# EAGLE design schematics (EAGLE 9.6.2)
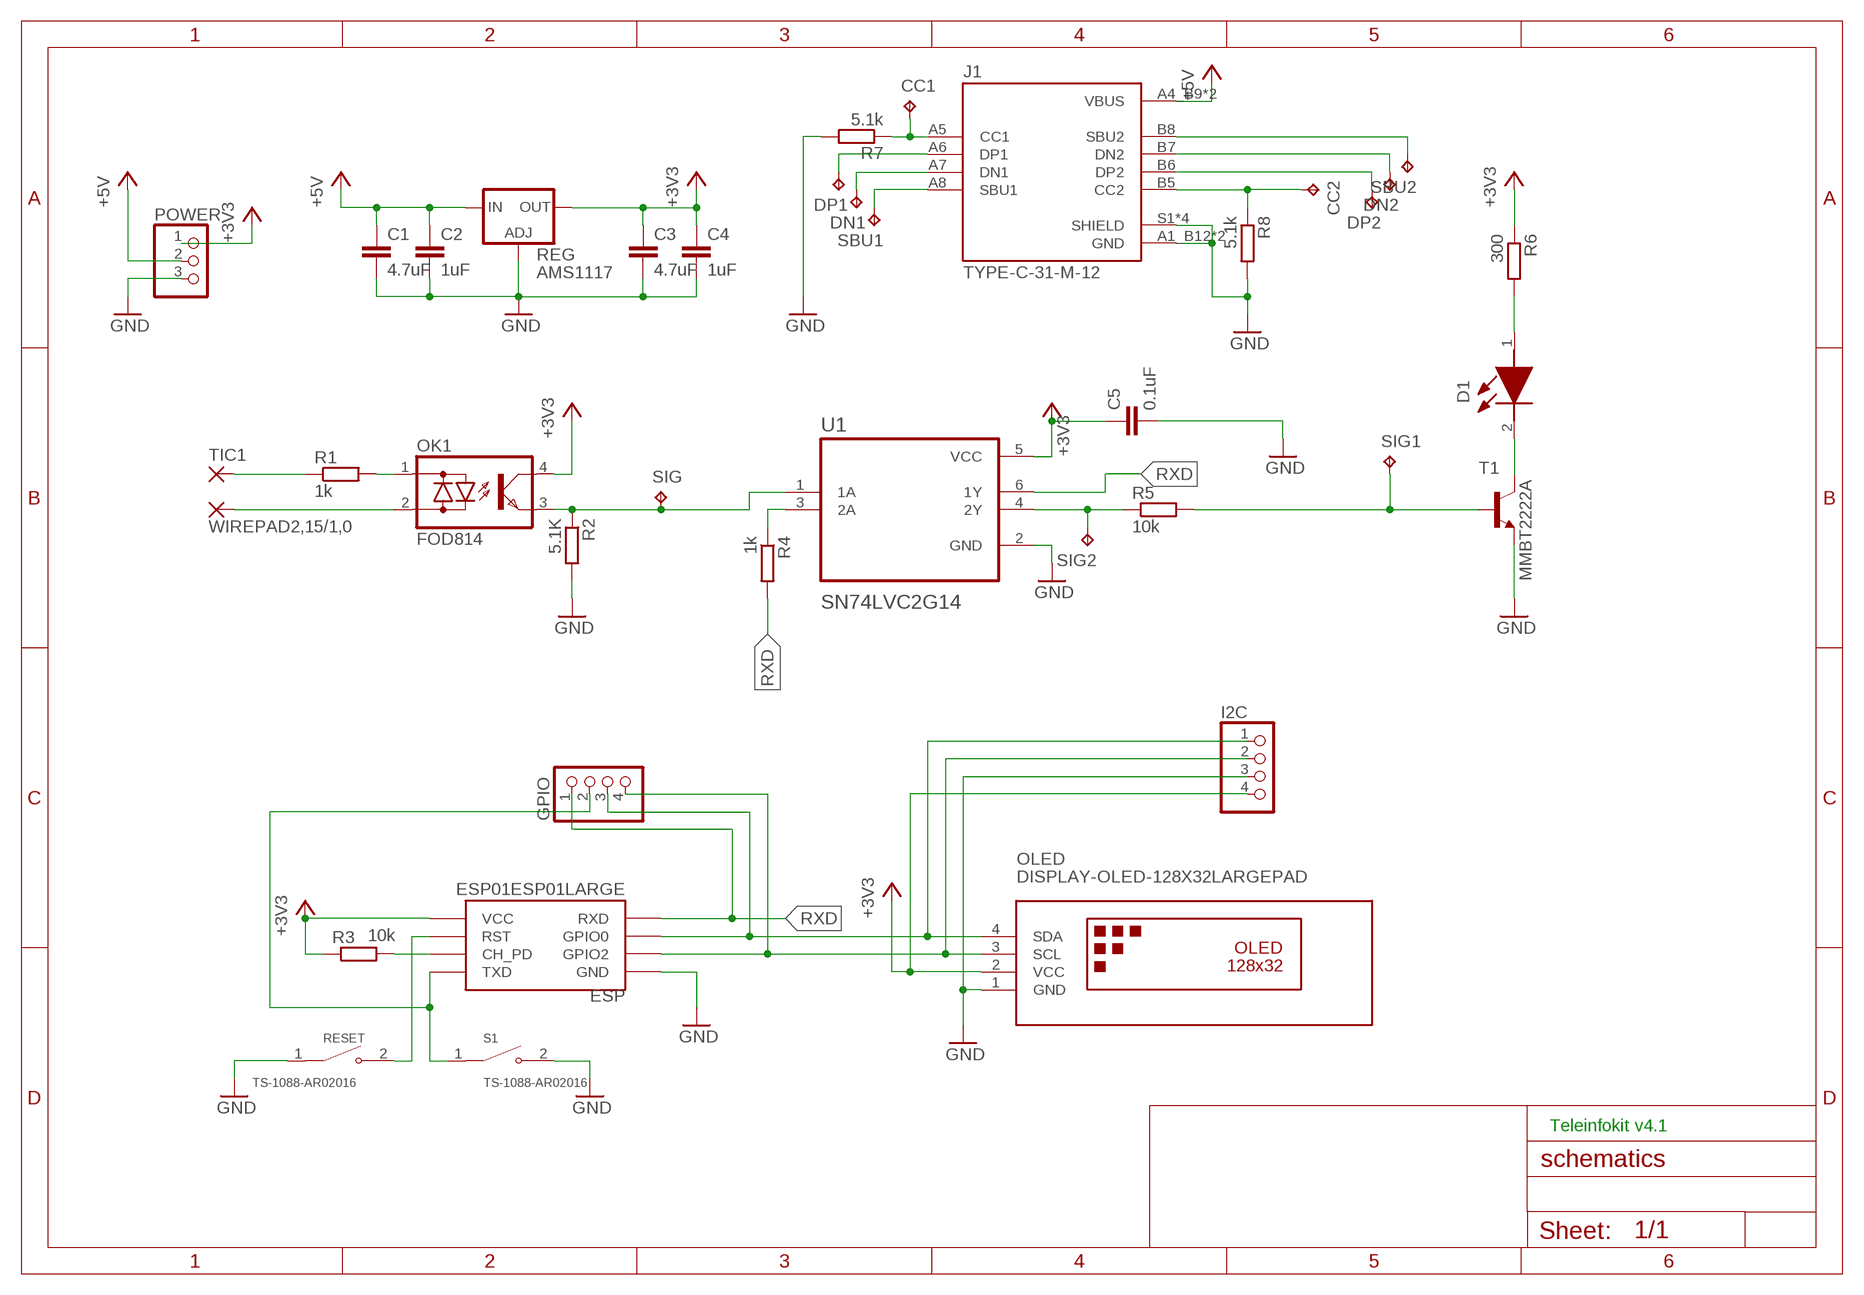
[diagram p0: schematic, sheet 1]

## Parts
C1  4.7uF  C-EUC0805  [C0805]
C2  1uF  C-EUC0805  [C0805]
C3  4.7uF  C-EUC0805  [C0805]
C4  1uF  C-EUC0805  [C0805]
C5  0.1uF  C-EUC0402K  [C0402K]
CC1  TPB1,27  [B1,27]
CC2  TPB1,27  [B1,27]
D1  17-21SURC_S530-A2_TR8  [1721SURCS530A2TR8]
DN1  TPB1,27  [B1,27]
DN2  TPB1,27  [B1,27]
DP1  TPB1,27  [B1,27]
DP2  TPB1,27  [B1,27]
ESP  ESP01ESP01LARGE  [ESP01LARGE]
GPIO  PINHD-1X4  [1X04]
I2C  PINHD-1X4ROUNDLARGE  [1X04ROUNDLARGE]
J1  TYPE-C-31-M-12  [HRO_TYPE-C-31-M-12]
OK1  FOD814  SFH6206  [DIL4-SMD]
OLED  DISPLAY-OLED-128X32LARGEPAD  [DISPLAY-OLED-128X32LARGE]
POWER  PINHD-1X3  [1X03]
R1  1k  R-EU_R0805  [R0805]
R2  5.1K  R-EU_R0603  [R0603]
R3  10k  R-EU_R0805  [R0805]
R4  1k  R-EU_R0805  [R0805]
R5  10k  R-EU_R0805  [R0805]
R6  300  R-EU_R0805  [R0805]
R7  5.1k  R-EU_R0402  [R0402]
R8  5.1k  R-EU_R0402  [R0402]
REG  AMS1117  LD117AS33TR  [SOT223]
RESET  TS-1088-AR02016  [SW_TS-1088-AR02016]
S1  TS-1088-AR02016  [SW_TS-1088-AR02016]
SBU1  TPB1,27  [B1,27]
SBU2  TPB1,27  [B1,27]
SIG  TPB1,27  [B1,27]
SIG1  TPB1,27  [B1,27]
SIG2  TPB1,27  [B1,27]
T1  MMBT2222A  MMBT2222ALT1-NPN-SOT23-BEC  [SOT23-BEC]
TIC1  WIREPAD2,15/1,0  [2,15/1,0]
TIC2  WIREPAD2,15/1,0  [2,15/1,0]
U1  SN74LVC2G14  SN74LVC2G14DBVR  [SOT95P280X145-6N]

## Nets
+3V3: C3.1 C4.1 C5.1 ESP.VCC I2C.4 OK1.4(C) OLED.2(VCC) POWER.1 R3.1 R6.1 REG.4(OUT) U1.5(VCC)
+5V: C1.1 C2.1 J1.A4_B9(VBUS) J1.B4_A9(VBUS) POWER.2 REG.3(IN)
GND: C1.2 C2.2 C3.2 C4.2 C5.2 ESP.GND I2C.3 J1.A1_B12(GND) J1.B1_A12(GND) J1.S1(SHIELD) J1.S2(SHIELD) J1.S3(SHIELD) J1.S4(SHIELD) OLED.1(GND) POWER.3 R2.2 R7.2 R8.2 REG.1(ADJ) RESET.1 S1.2 T1.E U1.2(GND)
N$1: OK1.1(AC1) R1.2
N$2: ESP.GPIO0 GPIO.3 I2C.1 OLED.4(SDA)
N$3: D1.1(A) R6.2
N$4: ESP.TX(TXD) GPIO.2 S1.1
N$5: R5.1 SIG2.TP U1.4(2Y)
N$6: ESP.GPIO2 GPIO.4 I2C.2 OLED.3(SCL)
N$7: R1.1 TIC1.1(P)
N$8: OK1.2(AC2) TIC2.1(P)
N$9: ESP.CH_PD R3.2
N$10: ESP.RST RESET.2
N$11: OK1.3(E) R2.1 SIG.TP U1.1(1A)
N$12: D1.2(K) T1.C
N$13: R5.2 SIG1.TP T1.B
N$14: CC1.TP J1.A5(CC1) R7.1
N$15: R4.1 U1.3(2A)
N$16: CC2.TP J1.B5(CC2) R8.1
N$17: DP1.TP J1.A6(DP1)
N$18: DN1.TP J1.A7(DN1)
N$19: J1.A8(SBU1) SBU1.TP
N$20: J1.B8(SBU2) SBU2.TP
N$21: DN2.TP J1.B7(DN2)
N$22: DP2.TP J1.B6(DP2)
RXD: ESP.RX(RXD) GPIO.1 R4.2 U1.6(1Y)

## Notes on the sheet
- Teleinfokit v4.1

## Library data of the parts
C1 C3 = rcl:C-EU: CAPACITOR, European symbol; LCSC_PART: C1779; SPICEPREFIX: C
C2 C4 = rcl:C-EU: CAPACITOR, European symbol; LCSC_PART: C28323; SPICEPREFIX: C
C5 = rcl:C-EU: CAPACITOR, European symbol; LCSC_PART: C1525; SPICEPREFIX: C
CC1 CC2 DN1 DN2 DP1 DP2 SBU1 SBU2 SIG SIG1 SIG2 = testpad:TP: Test pad
D1 = 17-21SURC_S530-A2_TR8:17-21SURC_S530-A2_TR8: Standard LEDs - SMD 1.1mm Height Source: Datasheet <https://media.digikey.com/pdf/Data Sheets/Everlight PDFs/17-21SURC-S530-A2-TR8-V5~.pdf>; ARROW_PART_NUMBER: 17-21SURC/S530-A2/TR8; ARROW_PRICE-STOCK: https://www.arrow.com/en/products/17-21surcs530-a2tr8/everlight-electronics; DESCRIPTION: Standard LEDs - SMD 1.1mm Height; HEIGHT: mm; MANUFACTURER_NAME: Everlight; MANUFACTURER_PART_NUMBER: 17-21SURC/S530-A2/TR8; MOUSER_PART_NUMBER: N/A; MOUSER_PRICE-STOCK: https://www.mouser.co.uk/ProductDetail/Everlight/17-21SURC-S530-A2-TR8?qs=8cKuZ6Ok2lY9160apvjjyQ%3D%3D
ESP = esp8266modules-edit:ESP01: ESP8266 Wifi module 01; LCSC_PART: C2935984
GPIO = pinhead:PINHD-1X4: PIN HEADER
I2C = pinhead-edit:PINHD-1X4: PIN HEADER
J1 = TYPE-C-31-M-12:TYPE-C-31-M-12: Check availability <https://pricing.snapeda.com/parts/TYPE-C-31-M-12/HRO%20Electronics%20Co.%2C%20Ltd./view-part?ref=eda>; AVAILABILITY: Not in stock; DESCRIPTION: USB Connectors 24 Receptacle 1 8.94*7.3mm RoHS; LCSC_PART: C165948; MF: HRO Electronics Co., Ltd.; MP: TYPE-C-31-M-12; PACKAGE: Package; PRICE: None
OK1 = optocoupler:SFH620: Optocoupler, Phototransistor Output, AC Input Source: http://www.vishay.com/docs/83675/sfh620.pdf; LCSC_PART: C479718; MF: VISHAY/TELEFUNKEN; MPN: SFH6206-3; OC_FARNELL: 1469585; OC_NEWARK: 58K2214
OLED = oled-edit:DISPLAY-OLED-128X32: 128x32 Dot Matrix OLED Module with I2C interface based on SSD1306 chip More details available here: http://www.tinyosshop.com/index.php?route=product/product&product_id=953 Schematic available here: http://www.tinyosshop.com/datasheet/OLED%2012832.pdf SSD1306 datasheet: https://cdn-shop.adafruit.com/datasheets/SSD1306.pdf Click here to find device on ebay.com <http://www.ebay.com/sch/oled+display+128x32+i2c>; LCSC_PART: C2718488
POWER = pinhead:PINHD-1X3: PIN HEADER
R1 = rcl:R-EU_: RESISTOR, European symbol; LCSC_PART: C17513; SPICEPREFIX: R
R2 = rcl:R-EU_: RESISTOR, European symbol; LCSC_PART: C23186; SPICEPREFIX: R
R3-R5 = rcl:R-EU_: RESISTOR, European symbol; LCSC_PART: C17414; SPICEPREFIX: R
R6 = rcl:R-EU_: RESISTOR, European symbol; LCSC_PART: C17617; SPICEPREFIX: R
R7 R8 = rcl:R-EU_: RESISTOR, European symbol; LCSC_PART: C25905; SPICEPREFIX: R
REG = v-reg:LD117A?*: Low drop fixed and adjustable positive voltage regulators 1 A Source: http://www.st.com/stonline/products/literature/ds/7194/ld1117axx.pdf; LCSC_PART: C6186
RESET S1 = TS-1088-AR02016:TS-1088-AR02016: Check availability <https://pricing.snapeda.com/parts/TS-1088-AR02016/Xunpu/view-part?ref=eda>; AVAILABILITY: Not in stock; CHECK_PRICES: https://www.snapeda.com/parts/TS-1088-AR02016/Xunpu/view-part/?ref=eda; DESCRIPTION: 50mA 4mm 100MΩ 100,000 Times 12V 160gf 3mm 2mm Round Button Vertical welding SPST SMD Tactile Switches ROHS; LCSC_PART: C720477; MF: Xunpu; MP: TS-1088-AR02016; PACKAGE: Package; PRICE: None; SNAPEDA_LINK: https://www.snapeda.com/parts/TS-1088-AR02016/Xunpu/view-part/?ref=snap
T1 = transistor:*-NPN-: NPN Transistror BF959 corrected 2008.03.06; LCSC_PART: C8512
TIC1 TIC2 = wirepad:WIREPAD: Wire PAD connect wire on PCB
U1 = SN74LVC2G14DBVR:SN74LVC2G14DBVR: Check availability <https://pricing.snapeda.com/parts/SN74LVC2G14DBVR/Texas%20Instruments/view-part?ref=eda>; AVAILABILITY: In Stock; DESCRIPTION: 2-ch, 1.65-V to 5.5-V inverters with Schmitt-Trigger inputs; LCSC_PART: C12401; MF: Texas Instruments; MP: SN74LVC2G14DBVR; PACKAGE: SOT-23-6 Texas Instruments; PRICE: None; PURCHASE-URL: https://pricing.snapeda.com/search/part/SN74LVC2G14DBVR/?ref=eda

## Board
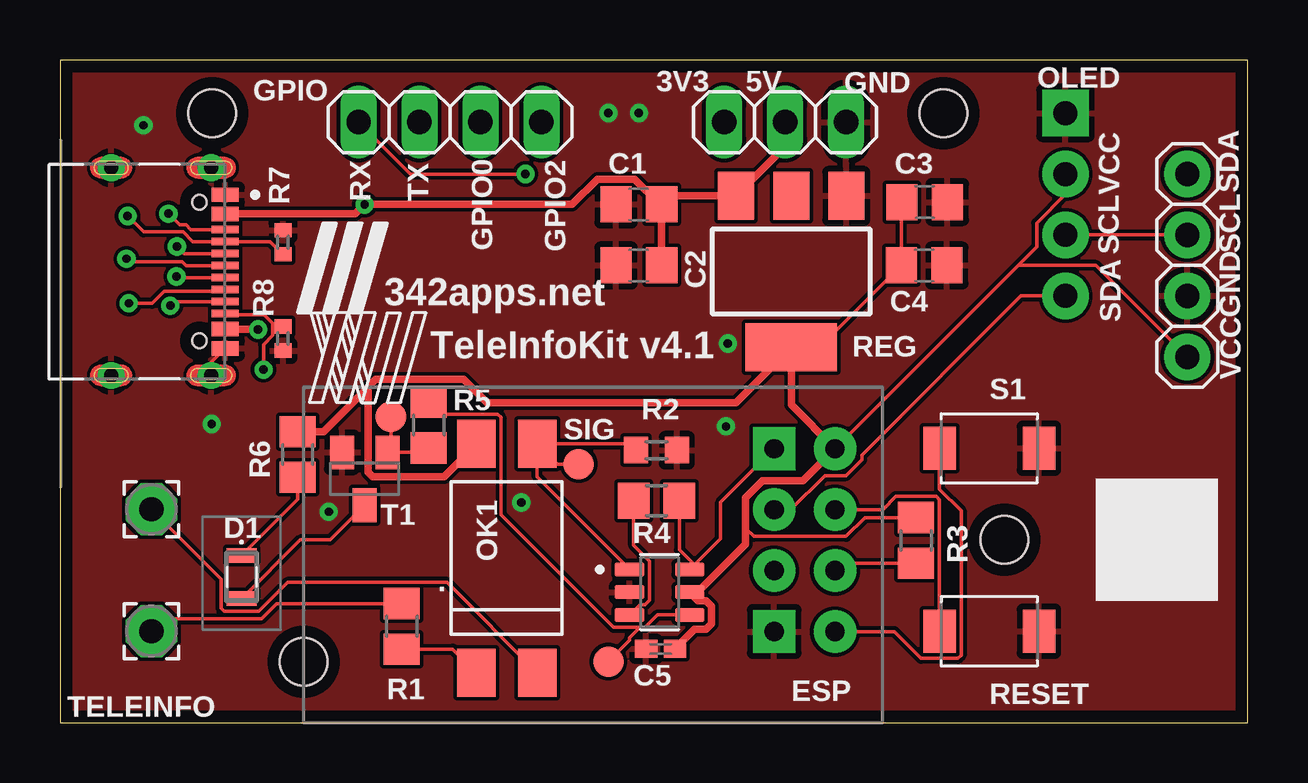
[diagram p1: board, top side]
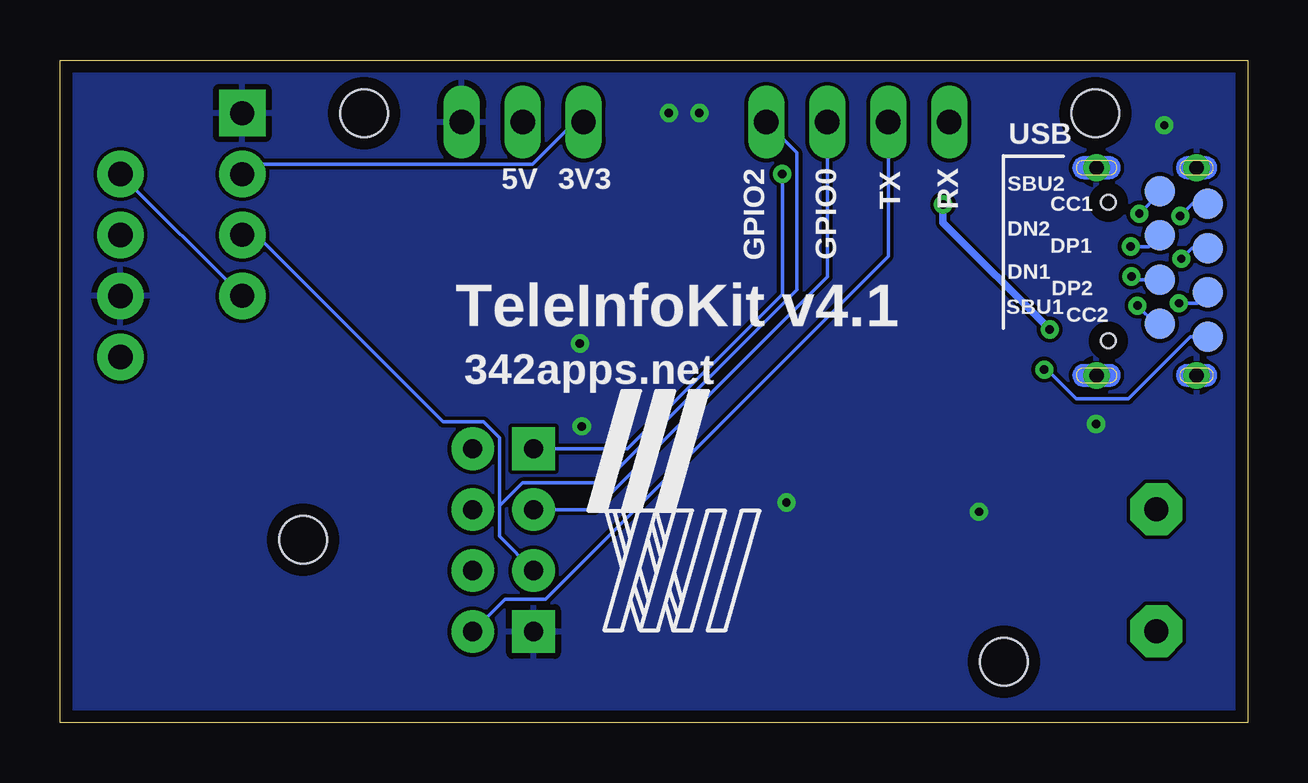
[diagram p2: board, bottom side, seen from below]

Size 49.51 x 27.61 mm. Coordinates in mm from the lower left corner, seen from the top.
Outline: 0,0 49.51,0 49.51,27.61 0,27.61 0,0
Copper layers (1*16): Top 0.035mm / dielectric 1.5mm / Bottom 0.035mm
Design rules "default *": minimum track width 6mil, minimum drill 0.35mm, track to track 6mil, track to pad 6mil, pad to pad 6mil, via to via 6mil, smd to smd 6mil, copper to edge 20mil, drill to drill 6mil, minimum pad ring 10mil, minimum via ring 8mil, stop-mask expansion 4mil, vias tented up to drill 0mil, thermal gap 10mil
Holes 1.98 mm at 6.35,25.4 10.16,2.54 39.37,7.62 36.83,25.4

### Footprints (pad centres in the part's own frame; a part is rotated, then mirrored left to right if it is on the bottom)
C0805 = smd 1.3 x 1.5: 1 -0.95,0; 2 0.95,0
C0402K = smd 0.925 x 0.74: 1 -0.6,0; 2 0.6,0
B1,27 = smd 1.27 x 1.27: TP 0,0
1721SURCS530A2TR8 = smd 0.6 x 1.25: 1 0.9,0; 2 -0.9,0
ESP01LARGE = drill 0.8 pad 1.778: CH_PD -1.285,-8.178; GPIO0 1.255,-5.638; GPIO2 -1.285,-5.638; RST 1.255,-8.178; TX -3.825,-8.178; VCC 3.795,-8.178 | drill 0.8 pad 1.778 square: GND -3.825,-5.638; RX 3.795,-5.638
1X04 = drill 1.016 long: 1 -3.81,0; 2 -1.27,0; 3 1.27,0; 4 3.81,0
1X04ROUNDLARGE = drill 1.016 pad 1.93: 1 -3.81,0; 2 -1.27,0; 3 1.27,0; 4 3.81,0
HRO_TYPE-C-31-M-12 = smd 0.6 x 1.14: A1_B12 -3.2,4.75; A4_B9 -2.4,4.75; B1_A12 3.2,4.75; B4_A9 2.4,4.75 | smd 0.3 x 1.14: A5 -1.25,4.75; A6 -0.25,4.75; A7 0.25,4.75; A8 1.25,4.75; B5 1.75,4.75; B6 0.75,4.75; B7 -0.75,4.75; B8 -1.75,4.75 | drill 0.6 pad 0.9: S1 -4.325,4.17; S2 4.325,4.17; S3 -4.325,0; S4 4.325,0 | hole 0.6: -2.89,3.68; 2.89,3.68
DIL4-SMD = smd 1.6 x 2: 1 -1.27,-4.77; 2 1.27,-4.77; 3 1.27,4.77; 4 -1.27,4.77
DISPLAY-OLED-128X32LARGE = drill 1 pad 1.93 square: 1 -17.78,-3.81 | drill 1 pad 1.93: 2 -17.78,-1.27; 3 -17.78,1.27; 4 -17.78,3.81
1X03 = drill 1.016 long: 1 -2.54,0; 2 0,0; 3 2.54,0
R0805 = smd 1.3 x 1.5: 1 -0.95,0; 2 0.95,0
R0603 = smd 1 x 1.1: 1 -0.85,0; 2 0.85,0
R0402 = smd 0.6 x 0.7: 1 -0.5,0; 2 0.5,0
SOT223 = smd 1.5 x 2: 1 -2.3,-3.15; 2 0,-3.15; 3 2.3,-3.15 | smd 3.8 x 2: 4 0,3.15
SW_TS-1088-AR02016 = smd 1.35 x 1.8: 1 -2.075,0; 2 2.075,0
SOT23-BEC = smd 1 x 1.4: B -0.95,-1.1; C 0,1.1; E 0.95,-1.1
2,15/1,0 = drill 1.016 pad 2.159 octagon: 1 0,0
SOT95P280X145-6N = smd 1.21 x 0.58: 1 -1.255,0.95; 2 -1.255,0; 3 -1.255,-0.95; 4 1.255,-0.95; 5 1.255,0; 6 1.255,0.95

### Placement (x,y rotation side)
C1  24.13,21.59 180 top
C2  24.13,19.05 180 top
C3  36.04,21.69 0 top
C4  36.02,19.05 0 top
C5  25.03,3.07 180 top
CC1  1.66,21.62 0 bottom
CC2  1.66,16.08 0 bottom
D1  7.57,6.07 90 top
DN1  3.66,18.46 0 bottom
DN2  3.66,20.3 0 bottom
DP1  1.66,19.77 0 bottom
DP2  1.66,17.92 0 bottom
ESP  24.13,7.62 90 top
GPIO  16.26,25.02 0 top
I2C  46.99,19.05 270 top
J1  2.13,18.8 270 top
OK1  18.62,6.86 0 top
OLED  24.13,21.59 180 top
POWER  30.23,25.02 0 top
R1  14.25,4.01 270 top
R2  24.87,11.35 0 top
R3  35.69,7.59 270 top
R4  24.87,9.25 0 top
R5  15.37,12.4 270 top
R6  9.91,11.18 270 top
R7  9.3,20.02 90 top
R8  9.3,16 270 top
REG  30.48,18.8 180 top
RESET  38.73,3.81 180 top
S1  38.73,11.43 0 top
SBU1  3.66,16.61 0 bottom
SBU2  3.66,22.15 0 bottom
SIG  21.62,10.77 0 top
SIG1  13.79,12.75 0 top
SIG2  22.86,2.54 0 top
T1  12.7,10.16 180 top
TIC1  3.81,3.81 0 top
TIC2  3.81,8.89 0 top
U1  24.99,5.44 0 top

### Tracks (layer width: path | path; a pad name or v marks a point on that pad's centre or on a via)
+3V3
  Top 0.152: REG.4 30.68,15.44 | C3.1 35.07,21.67 C4.1 32.77,16.76 31.66,15.65 31.46,15.44 30.68,15.44 | 29.73,15.44 30.68,15.44 | OLED.2 41.91,22.01 40.72,20.81 40.72,19.82 39.94,19.05 | I2C.4 43.18,19.05 39.94,19.05 | ESP.VCC 39.94,19.05 | R3.1 33.56,8.54 32.77,7.76 28.92,7.76 28.57,8.1
  Top 0.305: 12.84,13.98 13.16,14.3 16.83,14.3 17.8,13.34 28.17,13.34 REG.4 30.48,13.24 ESP.VCC 30.96,10.07 29.27,10.07 28.57,9.37 28.57,8.1 28.57,7.43 26.58,5.44 U1.5 26.6,5.08 26.94,5.08 27.16,4.86 27.16,4.11 26.94,3.89 26.45,3.89 C5.1 | 12.84,13.98 10.98,12.13 R6.1 | OK1.4 16.42,10.67 16.01,10.26 13.02,10.26 12.85,10.43 12.85,13.98 12.84,13.98
  Bottom 0.152: POWER.1 28.06,25.02 29.82,23.27 41.5,23.27 OLED.2
+5V  (via drill 0.35)
  Top 0.305: J1.A4_B9 12.31,21.2 v12.7,21.59 21.35,21.59 22.4,22.64 23.96,22.64 25.01,21.59 C1.1 | J1.B4_A9 8.24,16.4 v8.26,16.38 | C1.1 C2.1 | C1.1 25.44,21.95 REG.3 30.23,23.99 POWER.2
  Bottom 0.305: v8.26,16.38 12.7,20.83 v12.7,21.59
GND  (via drill 0.35)
  Top 0.152: J1.B1_A12 6.3,15.02 J1.S2
  other vias: 22.86,25.4 24.13,25.4 19.23,9.17 27.76,12.34 27.84,15.8 3.48,24.89 6.32,12.45 11.2,8.79
  pour Bottom: 0,27.94 49.53,27.94 49.53,0 0,0
  pour Top: 0,27.94 49.53,27.94 49.53,0 0,0
N$1
  Top 0.152: R1.2 16.37,3.06 OK1.1
N$2
  Top 0.152: ESP.GPIO0 30.45,8.88 31.88,10.3 32.77,10.3 33.42,10.95 33.42,11.14 40.06,17.78 OLED.4
  Bottom 0.152: GPIO.3 17.53,18.58 27.23,8.88 ESP.GPIO0 | I2C.1 OLED.4
N$3
  Top 0.152: R6.2 9.91,9.31 D1.1
N$4
  Top 0.152: S1.1 36.66,9.73 37.56,8.82 37.56,2.81 37.43,2.68 35.89,2.68 34.78,3.79 ESP.TX
  Bottom 0.152: ESP.TX 30.95,5.15 29.28,5.15 14.99,19.44 GPIO.2
N$5
  Top 0.152: 24.13,3.97 23.08,3.97 18.38,8.67 18.38,12.72 18.24,12.86 15.86,12.86 R5.1 15.83,12.88 | 24.13,3.97 24.4,3.97 24.91,4.49 U1.4 | SIG2.TP 23.74,3.42 23.74,3.54 24.13,3.92 24.13,3.97
N$6
  Top 0.152: OLED.3 I2C.2
  Bottom 0.152: GPIO.4 18.8,23.75 18.8,18.03 26.84,9.99 30.23,9.99 31.19,9.03 | ESP.GPIO2 31.19,7.76 31.19,8.89 31.19,9.03 | OLED.3 41.33,20.32 33.54,12.53 31.84,12.53 31.19,11.88 31.19,9.03
N$7
  Top 0.152: R1.1 9.04,4.96 8.41,4.34 4.34,4.34 TIC1.1
N$8
  Top 0.152: TIC2.1 6.72,5.98 6.72,4.78 6.85,4.64 8.29,4.64 9.49,5.84 16.13,5.84 OK1.2
N$9
  Top 0.152: ESP.CH_PD 32.62,6.64 R3.2
N$10
  Top 0.152: RESET.2 36.66,5.89 36.67,5.9 36.67,9.29 36.53,9.42 34.84,9.42 34.29,8.88 ESP.RST
N$11
  Top 0.152: OK1.3 19.89,10.24 U1.1 | OK1.3 23.64,11.63 R2.1 | OK1.3 20.75,10.77 SIG.TP
N$12
  Top 0.152: T1.C 11.26,7.62 10.02,7.62 D1.2
N$13
  Top 0.152: R5.2 15.18,11.26 T1.B 13.79,11.4 SIG1.TP
N$14  (via drill 0.35)
  Top 0.152: R7.1 8.77,20.05 J1.A5 5.53,20.05 5.13,20.44 3.48,20.44 v2.82,21.11
  Bottom 0.152: v2.82,21.11 2.31,21.61 CC1.TP
N$15
  Top 0.152: U1.3 24.17,4.92 24.4,4.92 24.57,5.09 24.57,6.73 23.92,7.38 R4.1
N$16  (via drill 0.35)
  Top 0.152: R8.1 8.99,16.5 8.86,16.63 | 8.86,16.63 8.51,16.99 6.94,16.99 J1.B5 | 8.86,16.63 8.86,16.13 8.48,15.75 v8.48,14.71
  Bottom 0.152: v8.48,14.71 8.36,14.71 7.14,13.49 4.98,13.49 2.39,16.08 CC2.TP
N$17  (via drill 0.35)
  Top 0.152: J1.A6 5.25,19.05 5.1,19.19 2.9,19.19 v2.77,19.33
  Bottom 0.152: v2.77,19.33 2.33,19.77 DP1.TP
N$18  (via drill 0.35)
  Top 0.152: J1.A7 4.89,18.55 v4.85,18.59
  Bottom 0.152: v4.85,18.59 4.72,18.46 DN1.TP
N$19  (via drill 0.35)
  Top 0.152: J1.A8 4.77,17.55 v4.6,17.37
  Bottom 0.152: v4.6,17.37 3.83,16.61 SBU1.TP
N$20  (via drill 0.35)
  Top 0.152: J1.B8 5.46,20.55 5.25,20.75 4.98,20.75 v4.52,21.21
  Bottom 0.152: v4.52,21.21 3.66,22.07 SBU2.TP
N$21  (via drill 0.35)
  Top 0.152: J1.B7 5.17,19.55 v4.88,19.84
  Bottom 0.152: v4.88,19.84 4.12,19.84 DN2.TP
N$22  (via drill 0.35)
  Top 0.152: v2.87,17.47 3.84,17.47 4.35,17.98 6.82,17.98 J1.B6
  Bottom 0.152: v2.87,17.47 2.11,17.47 DP2.TP
RXD  (via drill 0.35)
  Top 0.152: v19.4,22.86 14.61,22.86 GPIO.1 | U1.6 26.44,6.58 | 26.44,6.58 27.53,7.67 27.53,9.18 ESP.RX | R4.2 25.82,7.2 26.44,6.58
  Bottom 0.152: ESP.RX 25.85,11.41 19.4,17.86 v19.4,22.86

### Text on the board
tPlace: R5
tNames: GPIO | 3V3 | 5V | GND | OLED | C1 | C3 | RX | TX | VCC | SDA | GPIO0 | GPIO2 | SCL | SCL | 342apps.net | C4 | SDA | GND | TeleInfoKit v4.1 | REG | VCC | S1 | R4 | . | TELEINFO | ESP | RESET
bNames: USB | RX | TX | GPIO0 | GPIO2 | 3V3 | 5V | TeleInfoKit v4.1 | 342apps.net